# Altium schematic sheet sheet1.SchDoc
size A4
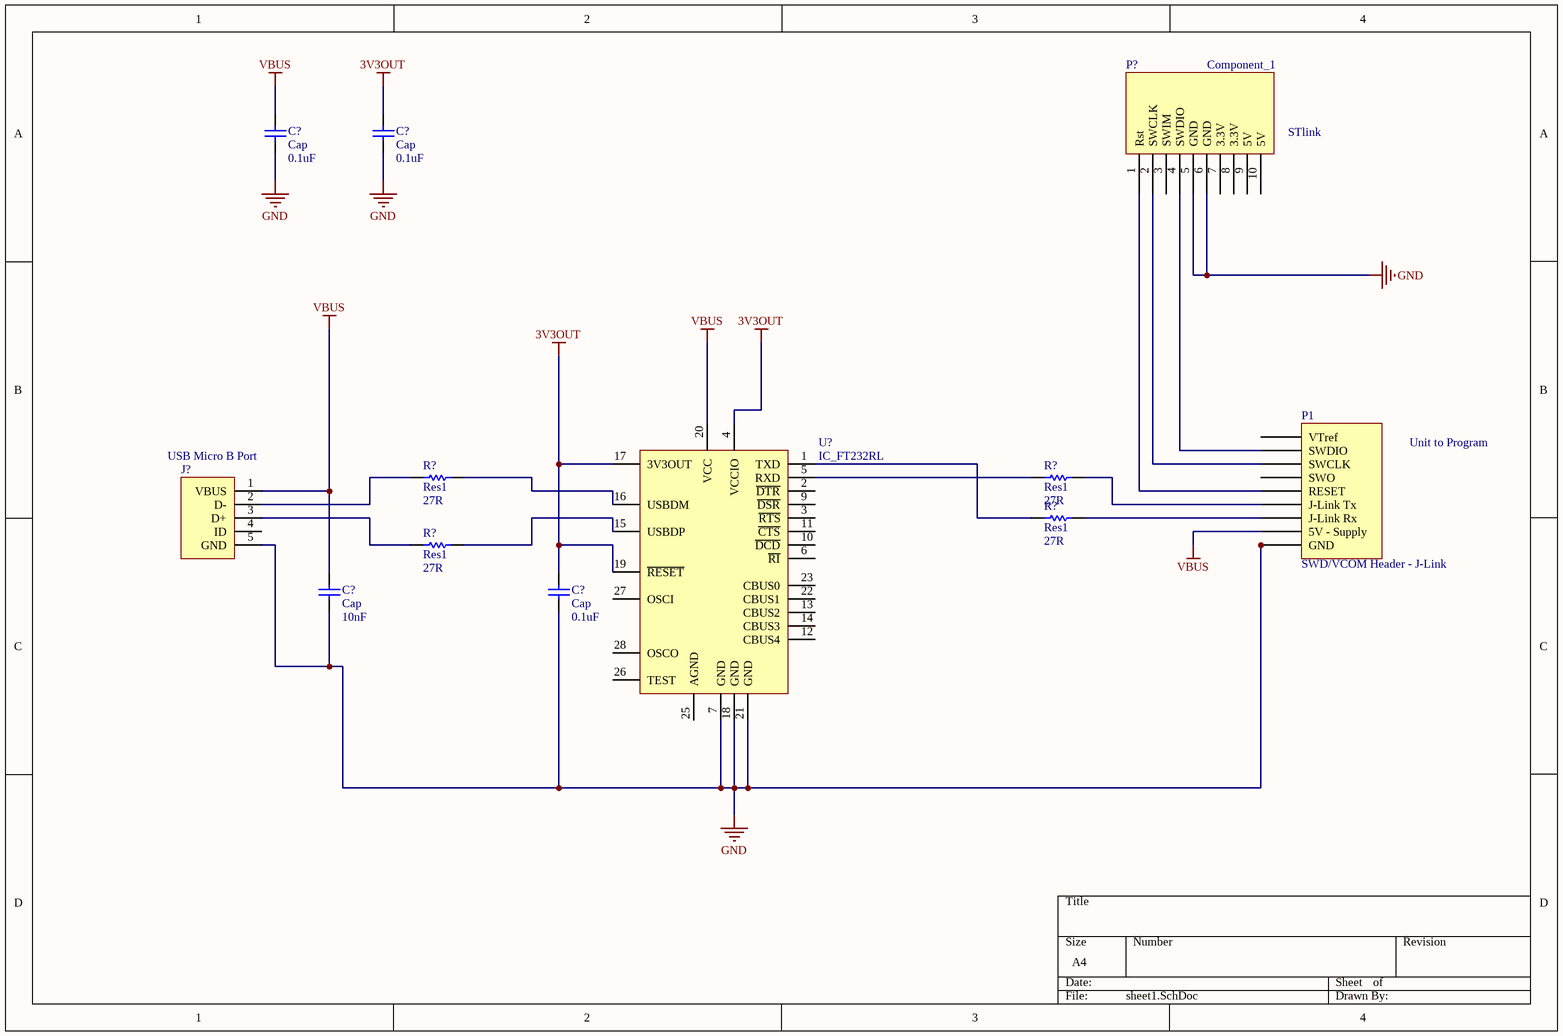
[diagram p0: sheet1.SchDoc]

## Parts
(Parts that share a designator on the sheet are numbered #1, #2 ... from top to bottom, then left to right.)
C?#1  Cap  value 0.1uF  [RAD-0.3]
C?#2  Cap  value 0.1uF  [RAD-0.3]
C?#3  Cap  value 10nF  [RAD-0.3]
C?#4  Cap  value 0.1uF  [RAD-0.3]
J?  USB Micro B Port
P1  SWD/VCOM Header - J-Link  [20 Pin 100 Mil Shrouded header with key]
P?  Component_1
R?#1  Res1  value 27R  [AXIAL-0.3]
R?#2  Res1  value 27R  [AXIAL-0.3]
R?#3  Res1  value 27R  [AXIAL-0.3]
R?#4  Res1  value 27R  [AXIAL-0.3]
U?  IC_FT232RL  [SSOP-28]

## Nets
3V3OUT: C?#2.2 C?#4.2 U?.4(VCCIO) U?.17(3V3OUT) U?.19(~{RESET})
GND: C?#1.1 C?#2.1 C?#3.1 C?#4.1 J?.5(GND) P1.4(GND) P1.6(GND) P1.8(GND) P1.10(GND) P1.12(GND) P?.5(GND) P?.6(GND) U?.7(GND) U?.18(GND) U?.21(GND)
NC: U?.8(NC) U?.24(NC)
VBUS: C?#1.2 C?#3.2 J?.1(VBUS) P1.19(5V_-_Supply) U?.20(VCC)
NetJ?_2: J?.2(D-) R?#1.1
NetJ?_3: J?.3(D+) R?#4.1
NetP1_5: P1.5(J-Link_Tx) R?#2.2
NetP1_7: P1.7(SWDIO) P?.4(SWDIO)
NetP1_9: P1.9(SWCLK) P?.2(SWCLK)
NetP1_15: P1.15(RESET) P?.1(Rst)
NetP1_17: P1.17(J-Link_Rx) R?#3.2
NetR?#1_2: R?#1.2 U?.16(USBDM)
NetR?#2_1: R?#2.1 U?.5(RXD)
NetR?#3_1: R?#3.1 U?.1(TXD)
NetR?#4_2: R?#4.2 U?.15(USBDP)

Not connected (* = marked no-connect by the designer): J? 4(ID); P1 1(VTref) 13(SWO); P? 3(SWIM) 7(3.3V) 8(3.3V) 9(5V) 10(5V); U? 2(~{DTR}) 3(~{RTS}) 6(~{RI}) 9(~{DSR}) 10(~{DCD}) 11(~{CTS}) 12(CBUS4) 13(CBUS2) 14(CBUS3) 22(CBUS1) 23(CBUS0) 25(AGND) 26(TEST) 27(OSCI) 28(OSCO)

## Notes on the sheet
- (near P?) STlink
- Unit to Program

## Library data of the parts
C?#1-C?#4 = Cap: Capacitor; Published: 8-Jun-2000; LatestRevisionDate: 17-Jul-2002; LatestRevisionNote: Re-released for DXP Platform.; PackageReference: RAD-0.3; Publisher: Altium Limited; PackageDescription: Radial Cap, Thru-Hole; 2 Leads; 0.3 in Pin Spacing
J? = Component_1
P1 = SWD/VCOM Header
R?#1-R?#4 = Res1: Resistor; Published: 8-Jun-2000; LatestRevisionDate: 17-Jul-2002; LatestRevisionNote: Re-released for DXP Platform.; PackageReference: AXIAL-0.3; Publisher: Altium Limited; PackageDescription: Axial Device, Thru-Hole; 2 Leads; 0.3 in Pin Spacing
U? = IC_FT232RL: FT232R USB UART; Manufacturer: *; Note: *; ManufacturerPartNo: *